# Altium schematic sheet Rev2_7500-8500.SchDoc
size A; SheetNumber: 1; SheetTotal: 1
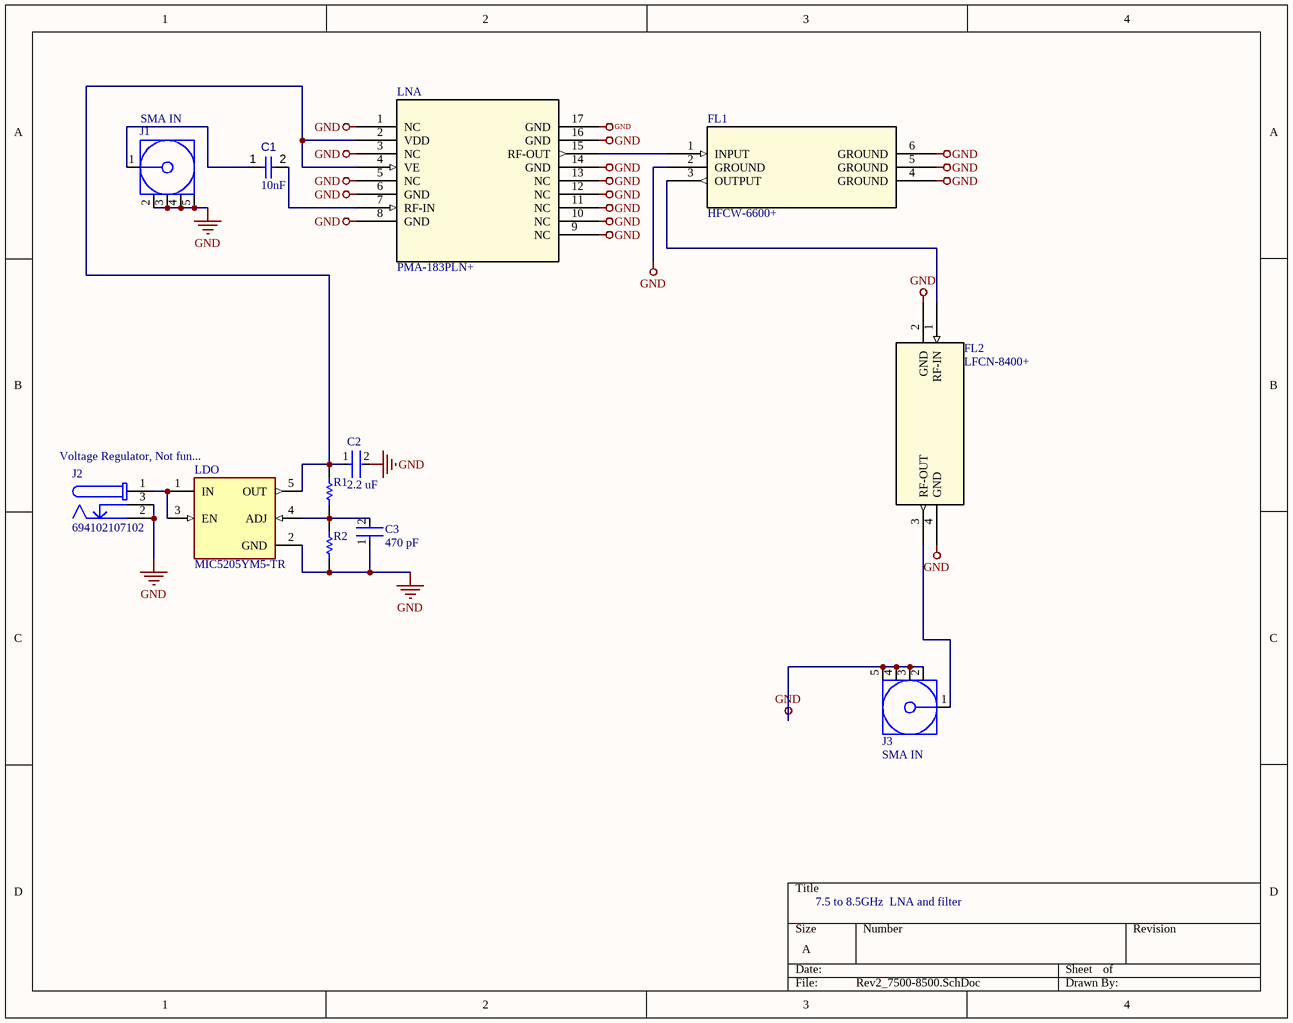
[diagram p0: Rev2_7500-8500.SchDoc]

## Parts
C1  value 10nF  [CAPC0402(1005)60_L]  (hidden comment: Capacitor 10nF +/-20% 50V 0402)
C2  2.2 uF  [FP-GRM188-0_1-e0_2_0_5-MFG]
C3  470 pF  [FP-0402-L_1_0_1-W_0_5_0_1-IPC_A]
FL1  HFCW-6600+  [JC0603C_MNC]
FL2  LFCN-8400+  [FV1206-4_MNC]
J1  SMA IN  [MOLX-731000114_V]
J2  694102107102  [694102107102]
J3  SMA IN  [MOLX-731000114_V]
LDO  MIC5205YM5-TR  [FP-SOT23-5LD-PL-1-MFG]
LNA  PMA-183PLN+  [JV2579_MNC]
R1  (no value)  [RESC2013X60X40LL20T25]
R2  (no value)  [RESC1005X40X25ML10T10]

## Nets
GND: C2.2 C3.1 FL1.2(GROUND) FL1.4(GROUND) FL1.5(GROUND) FL1.6(GROUND) FL2.2(GND) FL2.4(GND) J1.2 J1.3 J1.4 J1.5 J2.2 J2.3 J3.2 J3.3 J3.4 J3.5 LDO.2(GND) LNA.1(NC) LNA.3(NC) LNA.5(NC) LNA.6(GND) LNA.8(GND) LNA.9(NC) LNA.10(NC) LNA.11(NC) LNA.12(NC) LNA.13(NC) LNA.14(GND) LNA.16(GND) LNA.17(GND) R2.2
NetC1_1: C1.1 J1.1
NetC1_2: C1.2 LNA.7(RF-IN)
NetC2_1: C2.1 LDO.5(OUT) LNA.2(VDD) LNA.4(VE) R1.1
NetC3_2: C3.2 LDO.4(ADJ) R1.2 R2.1
NetFL1_1: FL1.1(INPUT) LNA.15(RF-OUT)
NetFL1_3: FL1.3(OUTPUT) FL2.1(RF-IN)
NetFL2_3: FL2.3(RF-OUT) J3.1
NetJ2_1: J2.1 LDO.1(IN) LDO.3(EN)

## Notes on the sheet
- Voltage Regulator, Not fun...
- 7.5 to 8.5GHz  LNA and filter

## Library data of the parts
C1 = CMP-001-00069-3: Chip Capacitor, 10nF +/-20%, 50V, 0402, Thickness 0.6 mm; Tolerance: 5%; Max Operating Temperature: 85°C; Pins: 2; Case/Package: 0402; Voltage Rating: 50V; Min Operating Temperature: -55°C; Mounting Technology: SMT
C2 = CMP-2006-02836-2: Chip Multilayer Ceramic Capacitors for General Purpose, 0603, 2.2uF, X7R, 15%, 10%, 10V; Case Code (Metric): 1608; Height: 0.8mm; Packaging: Cut Tape; Voltage: 10V; Lead Free: Lead Free; Min Operating Temperature: -55°C; Voltage Rating (DC): 10V; Max Operating Temperature: 125°C; Voltage Rating: 10V; Dielectric: X7R; Depth: 0.8mm; Case Code (Imperial): 0603; Termination: SMD/SMT; Case/Package: 0603; Number of Pins: 2; REACH SVHC: No SVHC; Mount: Surface Mount; Width: 0.031inch; Material: Ceramic; Capacitance: 2.2uF; Package Quantity: 1; Weight: 7.1E-05oz; Length: 1.6mm; Thickness: 0.035inch; Tolerance: 10%; Value: 2.2uF
C3 = CMP-1034-01502-3: General Purpose Ceramic Capacitor, 0402, 470pF, 10%, X7R, 15%, 50V; Series: -; Height: 0.5mm; Termination: SMD/SMT; Packaging: Tape and Reel; Tolerance: 10%; REACH SVHC: No SVHC; Package Quantity: 10000; Case Code (Imperial): 0402; Voltage: 50V; Depth: 0.5mm; Case Code (Metric): 1005; Voltage Rating: 50V; Radiation Hardening: No; Construction: Flat; Mount: Surface Mount; Dielectric: X7R; Min Operating Temperature: -55°C; Width: 0.5mm; Number of Pins: 2; Case/Package: 0402; RoHS Compliant: Yes; Thickness: 0.022inch; Lead Free: Lead Free; Voltage Rating (DC): 50V; Max Operating Temperature: 125°C; Capacitance: 470pF; Length: 1mm; Contact Plating: Tin; Value: 470pF
FL1 = HFCW-6600+: No Description Available; Mfr_Name: Mini Circuits; Type: DEV; Copyright: Copyright (C) 2024 Ultra Librarian. All rights reserved.; Manufacturer_Part_Number: HFCW-6600+; RefDes: RefDes
FL2 = LFCN-8400+: No Description Available; Mfr_Name: Mini Circuits; Copyright: Copyright (C) 2024 Ultra Librarian. All rights reserved.; Manufacturer_Part_Number: LFCN-8400+; RefDes: RefDes; Type: DEV
J1 J3 = CMP-2000-05487-1: SMA Right-Angle PCB Jack Receptacle, Brass Body, Gold Plated, 50 Ohm, 5-Pin THD, RoHS, Tray; Manufacturer: Molex; Datasheet Version: 09/2016; Package Description: 5-Pin Through Hole Device, Body 14.8 x 6.35 mm, Pitch 2.54 mm; Datasheet URL: http://www.molex.com/webdocs/datasheets/pdf/en-us/0731000114_RF_COAX_CONNECTORS.pdf; Manufacturer URL: http://www.molex.com/; Package Reference: 731000114; Mounting Technology: ThroughHole; Package URL: http://www.molex.com/pdm_docs/sd/731000114_sd.pdf
J2 = CMP-1502-00174-2: NexarPartId: 52645180; Connector Type: Power; Insulation Resistance: 100MΩ; Gender: Male; Current Rating: 5A; Voltage Rating: 18V; Shielding: Unshielded; Mount: Surface Mount; Packaging: Tape and Reel; Max Operating Temperature: 85°C; Color: Black; Contact Plating: Tin; Min Operating Temperature: -40°C; Housing Material: Polyamide; Termination: SMD/SMT; RoHS: Compliant; Contact Gender: Female; REACH SVHC: Unknown; Voltage Rating (DC): 18V; Operating Supply Voltage: 18V; Flammability Rating: UL94 V-0
LDO = CMP-06324-000022-1: IC REG LIN POS ADJ 150MA SOT23-5; Manufacturer: Microchip; Output Type: AdjustableProgrammable; Number Of Outputs: 1; Max Supply Voltage: 16V; Min Supply Voltage: 2.5V; Nominal Supply Current: 80-1300uA; Dropout Voltage: 165mV; Standoff Height: 0mm; Accuracy Percentage: 1%; Max Junction Temp: +125°C; ComponentLink2URL: http://ww1.microchip.com/downloads/en/DeviceDoc/20005785A.pdf; Temperature Range Low: -40°C; Mouser Description: LDO Voltage Regulators 150mA 1% Low Noise LDO (Lead Free); Lead Free: Yes; Device Class L3: Voltage Regulators - Linear; Temperature: -40°C to +125°C; Device Class L1: Integrated Circuits (ICs); Automotive: No; Temperature Range High: +125°C; Manufacturer Part Number: MIC5205YM5-TR; RoHS: TRUE; Device Class L2: Power Management ICs; Output Current: 150mA; Package: SOT23-5LD-PL-1; Digikey Description: IC REG LIN POS ADJ 150MA SOT23-5; ComponentLink2Description: Datasheet; Category: IC; Octopart: https://octopart.com/mic5205ym5-tr-microchip-66802135; Height: 1.45mm
LNA = PMA-183PLN+: No Description Available; Mfr_Name: Mini Circuits; Copyright: Copyright (C) 2024 Ultra Librarian. All rights reserved.; Manufacturer_Part_Number: PMA-183PLN+; RefDes: RefDes; Type: DEV
R1 = CMP-2001-00628-1: Manufacturer: Panasonic; Part Number: ERA6AEB331V
R2 = CMP-2002-05819-1: Part Number: ERA-2AEB621X; Manufacturer: Panasonic